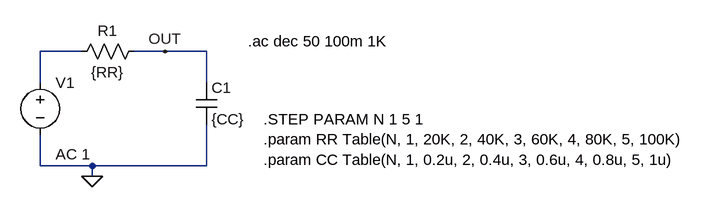
[diagram p0: schematic Fig_3-32_Table_C-R.asc]
Fig_3-32_Table_C-R.asc, the LTspice schematic file:
Version 4
SHEET 1 1228 680
WIRE 176 80 112 80
WIRE 304 80 256 80
WIRE 368 80 304 80
WIRE 112 128 112 80
WIRE 368 128 368 80
WIRE 112 256 112 208
WIRE 192 256 112 256
WIRE 368 256 368 192
WIRE 368 256 192 256
WIRE 192 272 192 256
FLAG 192 272 0
FLAG 304 80 OUT
SYMBOL voltage 112 112 R0
WINDOW 123 24 126 Left 2
WINDOW 39 0 0 Left 2
SYMATTR Value2 AC 1
SYMATTR InstName V1
SYMATTR Value ""
SYMBOL cap 352 128 R0
SYMATTR InstName C1
SYMATTR Value {CC}
SYMBOL res 160 96 R270
WINDOW 0 32 56 VTop 2
WINDOW 3 0 56 VBottom 2
SYMATTR InstName R1
SYMATTR Value {RR}
TEXT 432 64 Left 2 !.ac dec 50 100m 1K
TEXT 456 184 Left 2 !.STEP PARAM N 1 5 1\n.param RR Table(N, 1, 20K, 2, 40K, 3, 60K, 4, 80K, 5, 100K)\n.param CC Table(N, 1, 0.2u, 2, 0.4u, 3, 0.6u, 4, 0.8u, 5, 1u)

The netlist it stands for:
* Fig_3-32_Table_C-R.asc
V1 N001 0 AC 1
C1 OUT 0 {CC}
R1 N001 OUT {RR}
.ac dec 50 100m 1K
.STEP PARAM N 1 5 1
.param RR Table(N, 1, 20K, 2, 40K, 3, 60K, 4, 80K, 5, 100K)
.param CC Table(N, 1, 0.2u, 2, 0.4u, 3, 0.6u, 4, 0.8u, 5, 1u)
.backanno
.end